# EAGLE design CamAdapter (EAGLE 6.5.0)
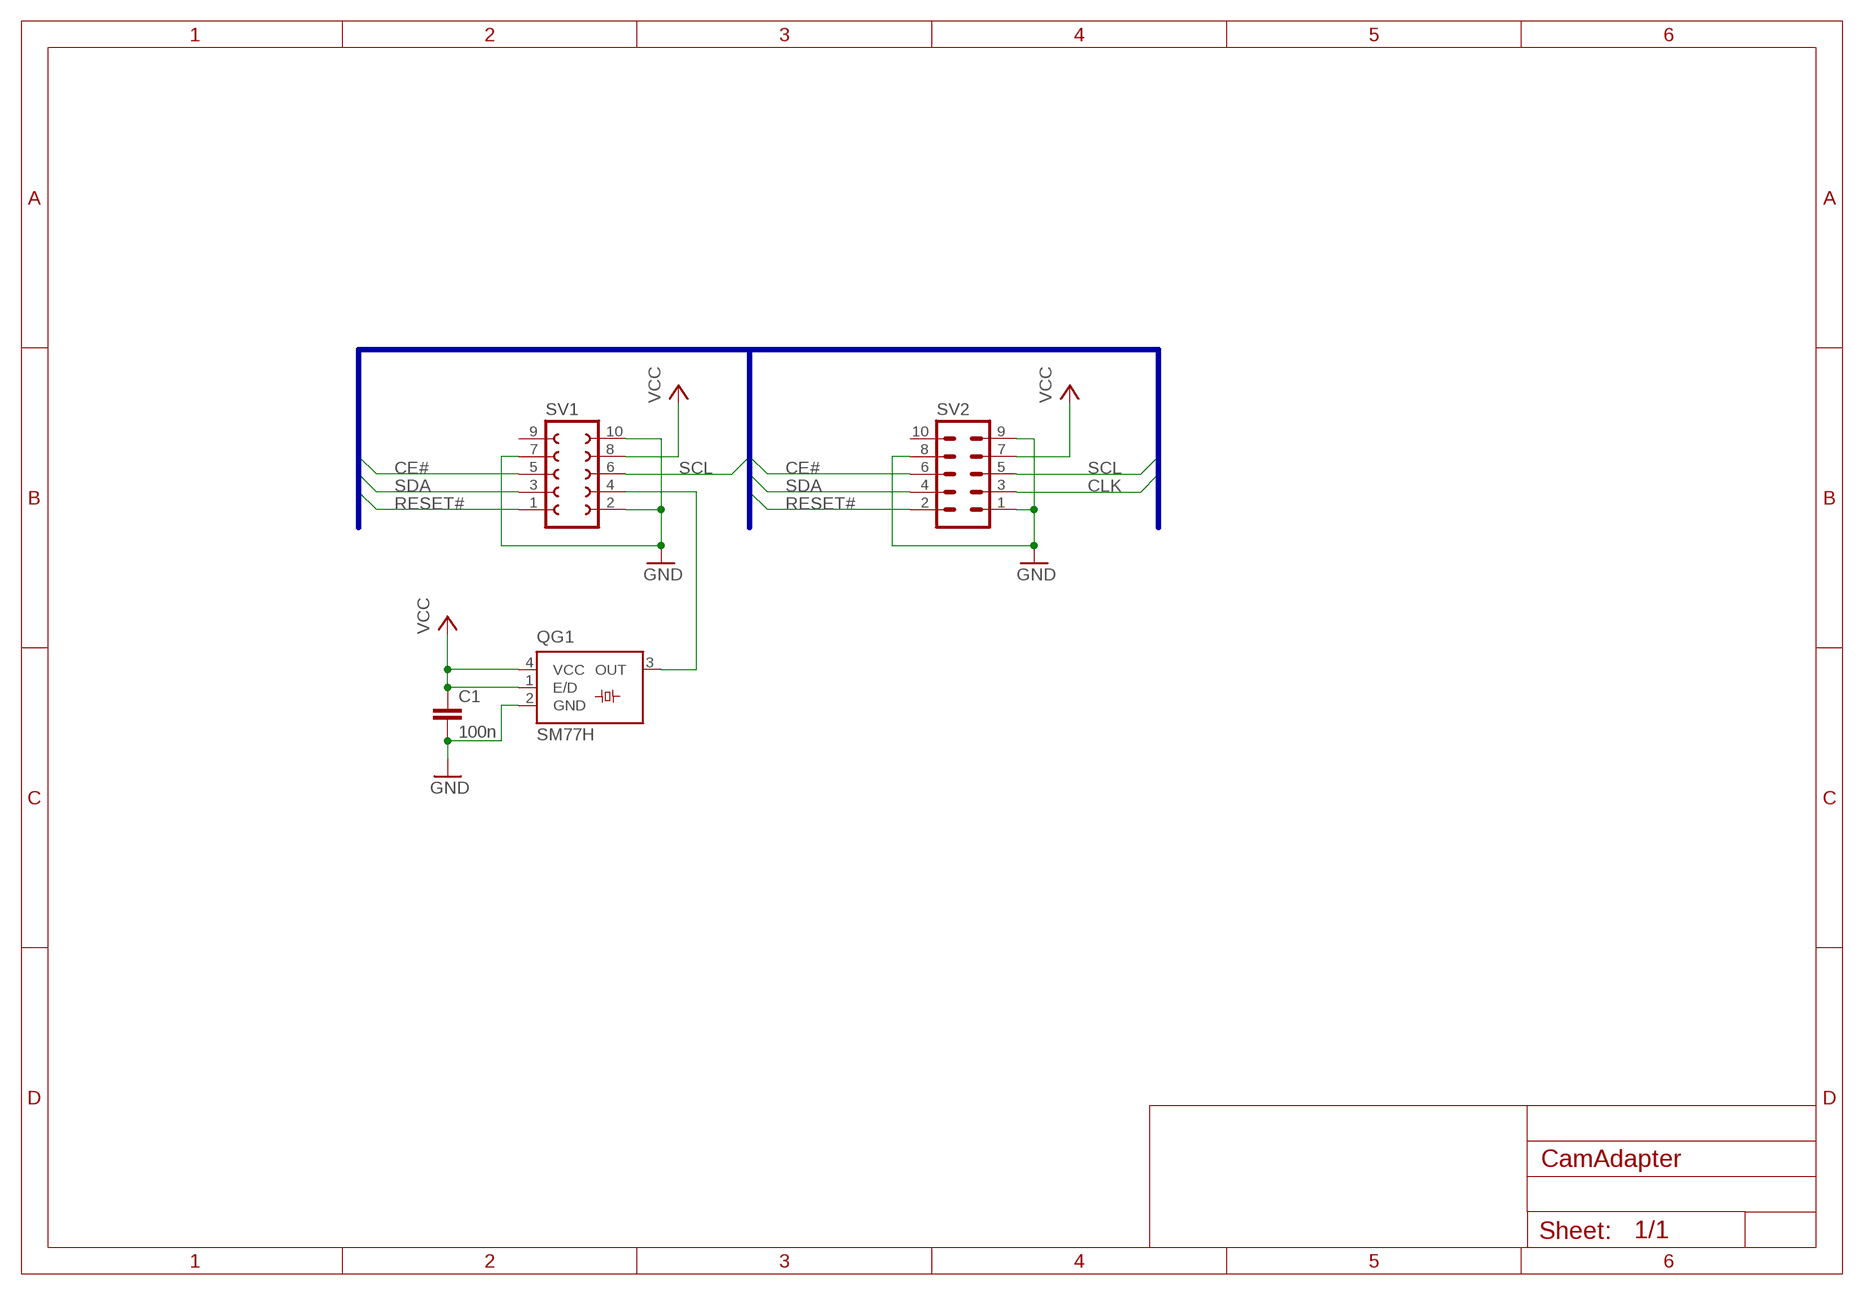
[diagram p0: schematic, sheet 1]

## Parts
C1  100n  C-EUC0805  [C0805]
QG1  SM77H  [SM77H]
SV1  FE05-2  [FE05-2]
SV2  ML10  [ML10]

## Nets
CE#: SV1.5 SV2.6
CLK: SV2.3
GND: C1.2 QG1.2(GND) SV1.2 SV1.7 SV1.10 SV2.1 SV2.8 SV2.9
N$1: QG1.3(OUT) SV1.4
RESET#: SV1.1 SV2.2
SCL: SV1.6 SV2.5
SDA: SV1.3 SV2.4
VCC: C1.1 QG1.1(E/D) QG1.4(VCC) SV1.8 SV2.7
Unconnected: SV1.9 SV2.10

## Buses
SDA,SCL,CLK,CE#,RESET#

## Library data of the parts
C1 = resistor:C-EU: CAPACITOR, European symbol
QG1 = crystal:SM77H: 3.3V CMOS Clock Oscillator Source: www.pletronics.com .. sm77h%203.3v.pdf; OC_FARNELL: unknown; OC_NEWARK: unknown
SV1 = con-lsta:FE05-2: FEMALE HEADER; OC_FARNELL: unknown; OC_NEWARK: unknown
SV2 = con-harting-ml:ML10: HARTING; OC_FARNELL: unknown; OC_NEWARK: unknown

## Board
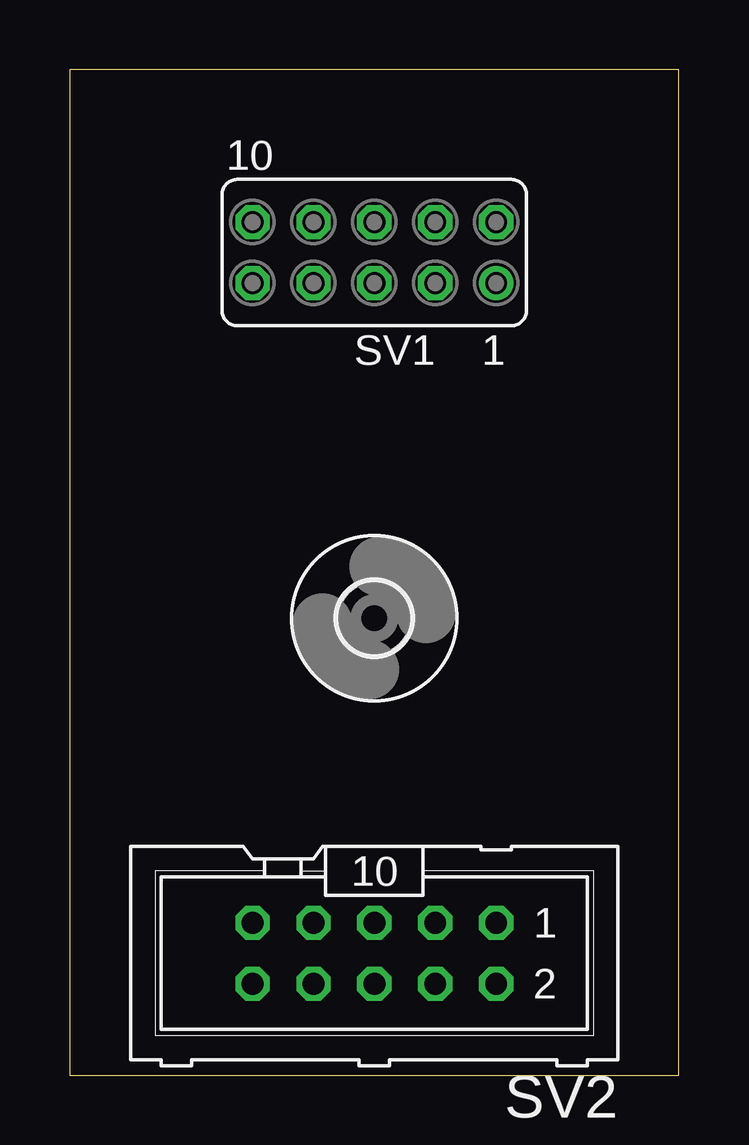
[diagram p1: board, top side]
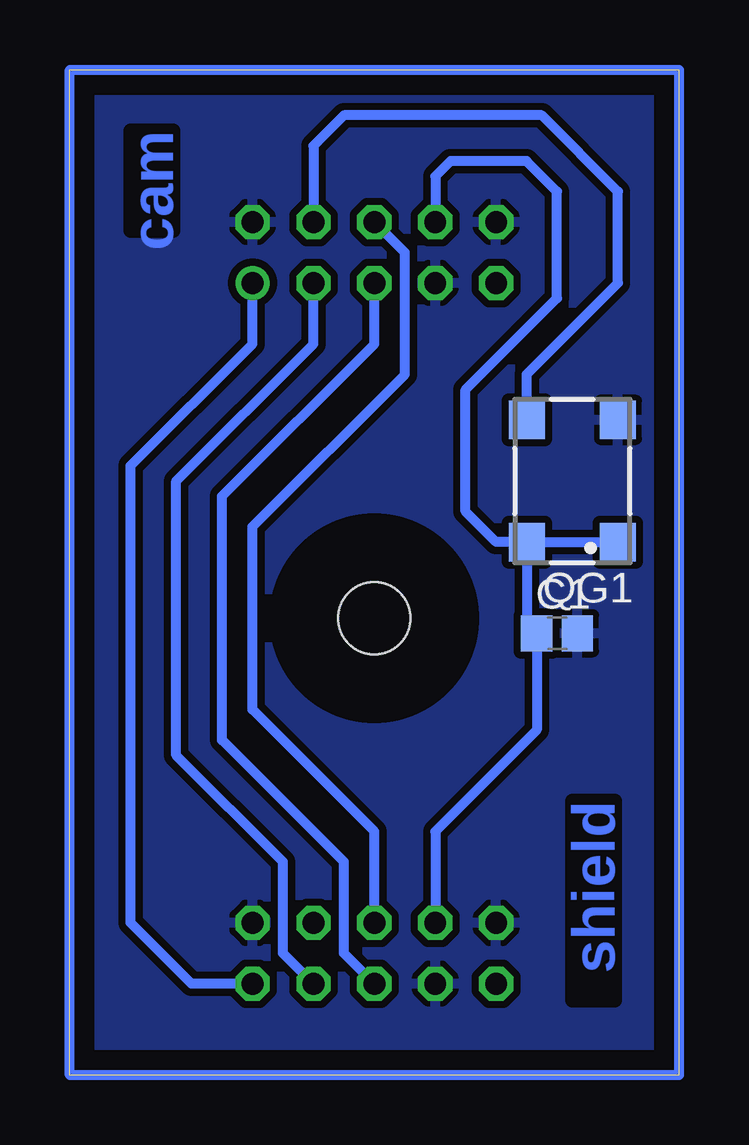
[diagram p2: board, bottom side, seen from below]

Size 25.4 x 41.91 mm. Coordinates in mm from the lower left corner, seen from the top.
Outline: 0,0 25.4,0 25.4,41.91 0,41.91 0,0
Copper layers (1*16): Top 0.035mm / dielectric 1.5mm / Bottom 0.035mm
Design rules "default *": minimum track width 10mil, minimum drill 24mil, track to track 12mil, track to pad 12mil, pad to pad 12mil, via to via 12mil, smd to smd 12mil, copper to edge 40mil, drill to drill 8mil, minimum pad ring 10mil, minimum via ring 8mil, stop-mask expansion 4mil, vias tented up to drill 0mil, thermal gap 10mil

### Footprints (pad centres in the part's own frame; a part is rotated, then mirrored left to right if it is on the bottom)
C0805 = smd 1.3 x 1.5: 1 -0.85,0; 2 0.85,0
SM77H = smd 1.6 x 1.5: 1 -2.55,-1.9; 2 2.55,-1.9; 3 2.55,1.9; 4 -2.55,1.9
FE05-2 = drill 0.914: 1 -5.08,1.27 | drill 0.914 octagon: 2 -5.08,-1.27; 3 -2.54,1.27; 4 -2.54,-1.27; 5 0,1.27; 6 0,-1.27; 7 2.54,1.27; 8 2.54,-1.27; 9 5.08,1.27; 10 5.08,-1.27
ML10 = drill 0.914 octagon: 1 -5.08,-1.27; 2 -5.08,1.27; 3 -2.54,-1.27; 4 -2.54,1.27; 5 0,-1.27; 6 0,1.27; 7 2.54,-1.27; 8 2.54,1.27; 9 5.08,-1.27; 10 5.08,1.27
3,0 = hole 3: 0,0

### Placement (x,y rotation side)
C1  5.08,18.41 0 bottom
QG1  4.45,24.77 90 bottom
SV1  12.7,34.29 180 top
SV2  12.7,5.08 180 top
U$1  [3,0]  12.7,19.05 0 top

### Tracks (layer width: path | path; a pad name or v marks a point on that pad's centre or on a via)
CE#
  Bottom 0.406: SV2.6 13.97,5.08 13.97,8.89 19.05,13.97 19.05,24.13 12.7,30.48 SV1.5
GND
  pour Bottom (isolate 0.305): -2.54,44.45 27.94,44.45 27.94,-2.54 -2.54,-2.54
N$1
  Bottom 0.406: SV1.4 15.24,38.73 13.97,40.01 5.71,40.01 2.54,36.83 2.54,33.02 6.34,29.21 QG1.3
N$2
  Bottom 0.406: 0,0 25.4,0 25.4,41.91 0,41.91 0,0
RESET#
  Bottom 0.406: SV2.2 20.32,3.81 22.86,6.35 22.86,25.4 17.78,30.48 SV1.1
SCL
  Bottom 0.406: SV2.5 12.7,10.16 17.78,15.24 17.78,22.86 11.43,29.21 11.43,34.29 SV1.6
SDA
  Bottom 0.406: SV2.4 16.51,5.08 16.51,8.89 20.95,13.34 20.95,24.77 15.24,30.48 SV1.3
VCC
  Bottom 0.406: 6.36,22.23 QG1.4 6.34,18.83 C1.1 5.93,14.39 10.16,10.16 SV2.7 | 6.36,22.23 7.62,22.23 8.89,23.5 8.89,28.57 5.08,32.38 5.08,36.83 6.35,38.1 9.53,38.1 10.16,37.47 SV1.8 | 6.36,22.23 2.56,22.23 QG1.1

### Text on the board
Bottom: cam | shield